# Altium schematic sheet RoBeast_Current_Sense.SchDoc: Current Sense
size A4; ApprovedBy: CR; DrawnBy: VM & IG; Revision: V1; SheetNumber: 8; SheetTotal: 9
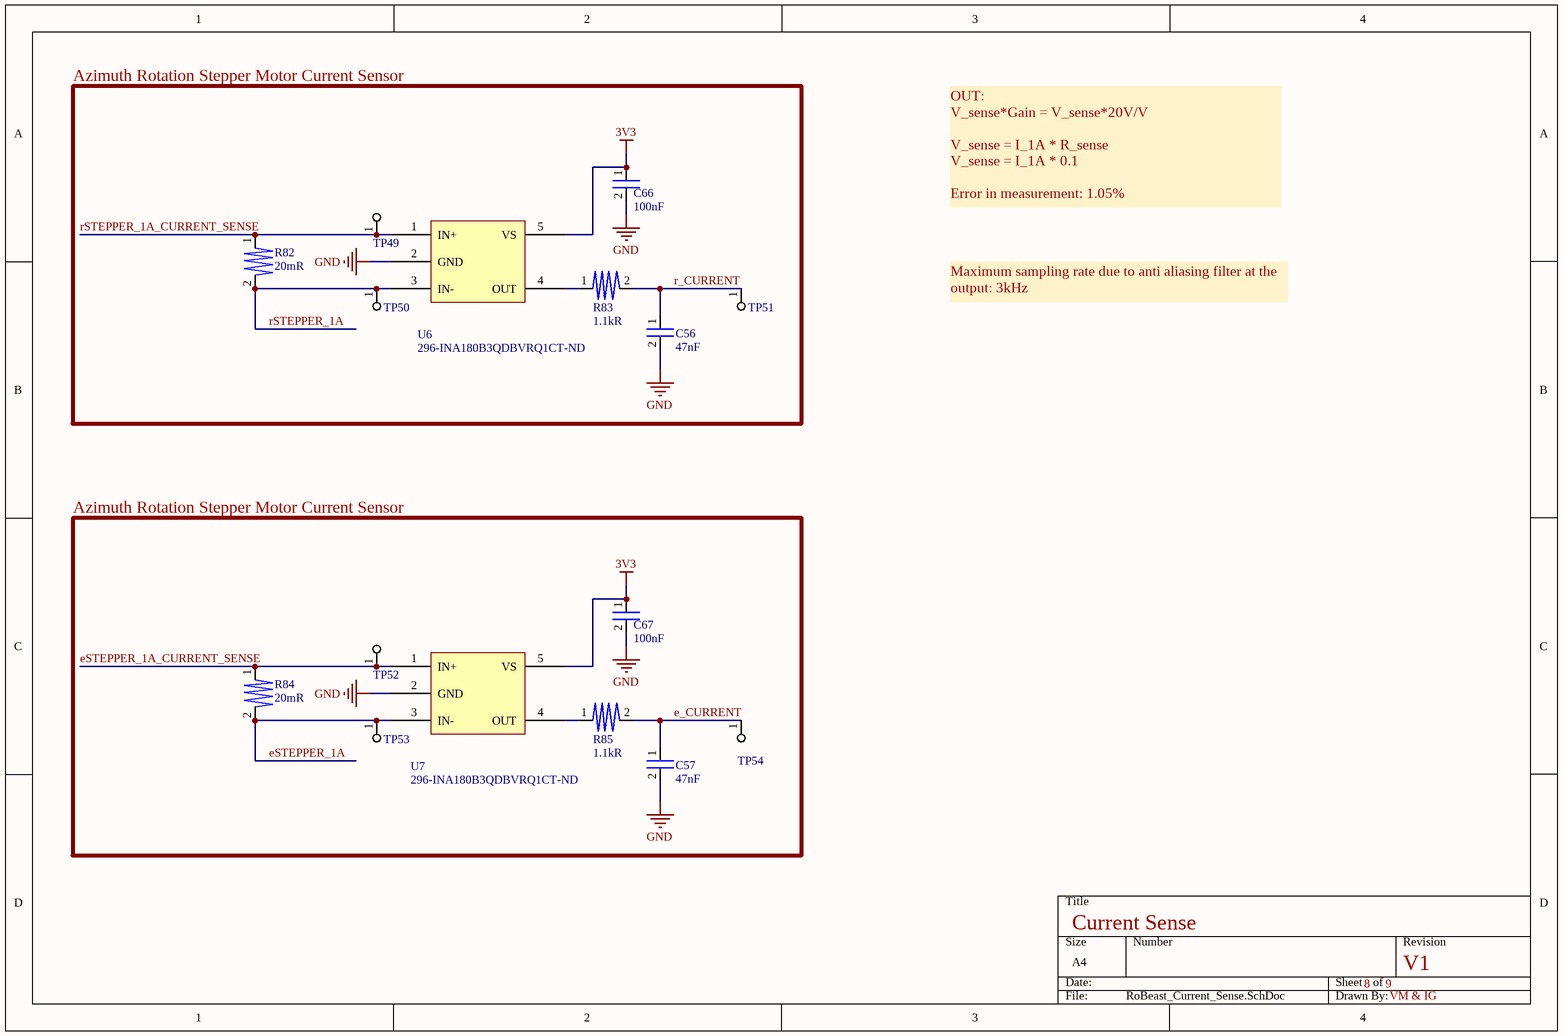
[diagram p0: RoBeast_Current_Sense.SchDoc]

## Parts
C56  47nF  [0805]
C57  47nF  [0805]
C66  100nF  [0805]
C67  100nF  [0805]
R82  20mR  [0805]
R83  1.1kR  [0805]
R84  20mR  [0805]
R85  1.1kR  [0805]
TP49  Test Point  [RCWCTE]  (value not drawn)
TP50  Test Point  [RCWCTE]  (value not drawn)
TP51  Test Point  [RCWCTE]  (value not drawn)
TP52  Test Point  [RCWCTE]  (value not drawn)
TP53  Test Point  [RCWCTE]  (value not drawn)
TP54  Test Point  [RCWCTE]  (value not drawn)
U6  Supplier Part Number 1: 296-INA180B3QDBVRQ1CT-ND  [INA180B3QDBVRQ1]  (hidden comment: Current Sensor, Gain 100V/V)
U7  Supplier Part Number 1: 296-INA180B3QDBVRQ1CT-ND  [INA180B3QDBVRQ1]  (hidden comment: Current Sensor, Gain 100V/V)

## Blocks framed on the sheet
Azimuth Rotation Stepper Motor Current Sensor: C56 C66 R82 R83 TP49-TP51 U6
Azimuth Rotation Stepper Motor Current Sensor: C57 C67 R84 R85 TP52-TP54 U7

## Nets
3V3: C66.1 C67.1 U6.5(VS) U7.5(VS)
GND: C56.2 C57.2 C66.2 C67.2 U6.2(GND) U7.2(GND)
e_CURRENT: C57.1 R85.2 TP54.1
eSTEPPER_1A: R84.2 TP53.1 U7.3(IN-)
eSTEPPER_1A_CURRENT_SENSE: R84.1 TP52.1 U7.1(IN+)
r_CURRENT: C56.1 R83.2 TP51.1
rSTEPPER_1A: R82.2 TP50.1 U6.3(IN-)
rSTEPPER_1A_CURRENT_SENSE: R82.1 TP49.1 U6.1(IN+)
NetR83_1: R83.1 U6.4(OUT)
NetR85_1: R85.1 U7.4(OUT)

## Notes on the sheet
- OUT:
  V_sense*Gain = V_sense*20V/V
  V_sense = I_1A * R_sense
  V_sense = I_1A * 0.1
  Error in measurement: 1.05%
- Maximum sampling rate due to anti aliasing filter at the output: 3kHz

## Library data of the parts
C56 C57 = CL21B473KBCNNNC: Ceramic Capacitor, Multilayer, Ceramic, 50V, 10% +Tol, 10% -Tol, X7R, 15% TC, 0.047uF, Surface Mount, 0805; Manufacturer: Samsung; Multilayer: Yes; Supplier 1: Digikey; Manufacturer Part Number: CL21B473KBCNNNC; RoHS: Yes; Category: Ceramic Capacitors; Stock 1: 502166; Pricing 1: 1=0.1, 10=0.036, 50=0.0208, 100=0.0161, 500=0.01212, 1000=0.00953 (USD); Mount: Surface Mount; Number of Pins: 2; Dielectric Material: Ceramic; Package Shape: Rectangular; Size Code: 0805; Terminal Finish: Nickel; Min Operating Temperature: -55°C; Max Operating Temperature: 125°C; JESD-609 Code: e3; Capacitance: 47nF; Capacitor Type: Ceramic; Negative Tolerance: 10%; Package Style: SMTMeter; Packaging: Tape and Reel; Positive Tolerance: 10%; Rated DC Voltage (URdc): 50V; Temperature Characteristics Code: X7R; Termination: Wraparound; Length: 2mm; Width: 1.25mm; Height: 0.85mm; Reach SVHC Compliant: Yes; RoHS Compliant: Yes; ComponentLink1URL: https://datasheet.ciiva.com:443/pdfs/VipMasterIC/IC/SEMS/SEMS-S-A0008523078/SEMS-S-A0008523078-1.pdf?src-supplier=IHS+Markit; ComponentLink1Description: https://datasheet.ciiva.com:443/pdfs/VipMasterIC/IC/SEMS/SEMS-S-A0008523078/SEMS-S-A0008523078-1.pdf?src-supplier=IHS+Markit; ComponentLink2URL: https://datasheet.ciiva.com/15195/getdatasheetpartid-357428-15195917.pdf?src-supplier=Verical; ComponentLink2Description: https://datasheet.ciiva.com/15195/getdatasheetpartid-357428-15195917.pdf?src-supplier=Verical; ComponentLink3URL: https://datasheet.ciiva.com/29199/454396-da-01-en-vs-kondensator-0805-29199678.pdf?src-supplier=Conrad; ComponentLink3Description: https://datasheet.ciiva.com/29199/454396-da-01-en-vs-kondensator-0805-29199678.pdf?src-supplier=Conrad; ComponentLink4URL: https://datasheet.ciiva.com/16289/cl05b104kq5nnnc-16289529.pdf?src-supplier=Future+Electronics; ComponentLink4Description: https://datasheet.ciiva.com/16289/cl05b104kq5nnnc-16289529.pdf?src-supplier=Future+Electronics; Supplier Part Number 1: 1276-1250-1-ND
C66 C67 = C0805C104J5RAC7800: Ceramic Capacitor, Multilayer, Ceramic, 50V, 5% +Tol, 5% -Tol, X7R, 15% TC, 0.1uF, Surface Mount, 0805; Manufacturer: KEMET; Manufacturer Part Number: C0805C104J5RACTU; Multilayer: Yes; Supplier 1: Digikey; RoHS: Yes; Category: Ceramic Capacitors; Stock 1: 605061; Pricing 1: 1=0.18, 10=0.122, 50=0.0732, 100=0.0576, 500=0.04252, 1000=0.03519 (USD); Mount: Surface Mount; Number of Pins: 2; Dielectric Material: Ceramic; Package Shape: Rectangular; Size Code: 0805; Terminal Finish: Nickel; Min Operating Temperature: -55°C; Max Operating Temperature: 125°C; JESD-609 Code: e3; Capacitor Type: Ceramic; Negative Tolerance: 5%; Packaging: Tape and Reel; Positive Tolerance: 5%; Rated DC Voltage (URdc): 50V; Temperature Characteristics Code: X7R; Termination: Wraparound; Reach SVHC Compliant: Yes; RoHS Compliant: Yes; ComponentLink1URL: http://capacitoredge.kemet.com:80/capedge2/intellispec.jsp?pn=C0805C104J5RACTU&displayPN=C0805C104J5RACTU&src-supplier=IHS+Markit; ComponentLink1Description: http://capacitoredge.kemet.com:80/capedge2/intellispec.jsp?pn=C0805C104J5RACTU&displayPN=C0805C104J5RACTU&src-supplier=IHS+Markit; ComponentLink2URL: https://datasheet.ciiva.com/7842/1732721-7842179.pdf?src-supplier=Element14; ComponentLink2Description: https://datasheet.ciiva.com/7842/1732721-7842179.pdf?src-supplier=Element14; ComponentLink3URL: https://datasheet.ciiva.com/28682/1851736-28682223.pdf?src-supplier=Element14; ComponentLink3Description: https://datasheet.ciiva.com/28682/1851736-28682223.pdf?src-supplier=Element14; ComponentLink4URL: https://datasheet.ciiva.com/7258/1828800-7258413.pdf?src-supplier=Newark; ComponentLink4Description: https://datasheet.ciiva.com/7258/1828800-7258413.pdf?src-supplier=Newark; ComponentLink5URL: https://datasheet.ciiva.com/14589/70095383-14589015.pdf?src-supplier=Allied+Electronics; ComponentLink5Description: https://datasheet.ciiva.com/14589/70095383-14589015.pdf?src-supplier=Allied+Electronics; ComponentLink6URL: https://datasheet.ciiva.com/5417/kem-c1002-x7r-smd-5417352.pdf?src-supplier=Mouser; ComponentLink6Description: https://datasheet.ciiva.com/5417/kem-c1002-x7r-smd-5417352.pdf?src-supplier=Mouser; ComponentLink7URL: https://datasheet.ciiva.com/39122/docfinderpartnumberc0402c102k5ractu-39122924.pdf?src-supplier=Onlinecomponents.com; ComponentLink7Description: https://datasheet.ciiva.com/39122/docfinderpartnumberc0402c102k5ractu-39122924.pdf?src-supplier=Onlinecomponents.com; Supplier Part Number 1: 399-C0805C104J5RAC7800CT-ND; Capacitance: 100nF
R82 R84 = ERJ-6CWDR020V: Resistor Thick Film 0.02Ohm 0.5% 0.5W 2-Pin 0805 T/R; Manufacturer: Panasonic; Supplier 1: Digikey; Manufacturer Part Number: ERJ-6CWDR020V; RoHS: No; Category: Chip SMD Resistors; Stock 1: 1997; Pricing 1: 1=0.61, 10=0.427, 25=0.3652, 50=0.3176, 100=0.2488, 250=0.22764, 500=0.1853, 1000=0.14697 (USD); ComponentLink1URL: https://datasheet.octopart.com/ERJ-6CWDR020V-Panasonic-datasheet-68299093.pdf?src-supplier=Future+Electronics; ComponentLink1Description: https://datasheet.octopart.com/ERJ-6CWDR020V-Panasonic-datasheet-68299093.pdf?src-supplier=Future+Electronics; ComponentLink2URL: http://industrial.panasonic.com/cdbs/www-data/pdf/RDN0000/AOA0000C313.pdf?src-supplier=Newark; ComponentLink2Description: http://industrial.panasonic.com/cdbs/www-data/pdf/RDN0000/AOA0000C313.pdf?src-supplier=Newark; ComponentLink3URL: http://industrial.panasonic.com/cdbs/www-data/pdf/RDN0000/AOA0000C313.pdf?src-supplier=Farnell; ComponentLink3Description: http://industrial.panasonic.com/cdbs/www-data/pdf/RDN0000/AOA0000C313.pdf?src-supplier=Farnell; ComponentLink4URL: https://industrial.panasonic.com/cdbs/www-data/pdf/RDN0000/AOA0000C313.pdf?src-supplier=Digikey; ComponentLink4Description: https://industrial.panasonic.com/cdbs/www-data/pdf/RDN0000/AOA0000C313.pdf?src-supplier=Digikey; Supplier Part Number 1: P124408CT-ND
R83 R85 = RCS08051K10FKEA: Fixed Resistor, Metal Glaze/thick Film, 0.4W, 1100ohm, 150V, 1% +/-Tol, 100ppm/Cel, Surface Mount, 0805; Manufacturer: Vishay Dale; Supplier 1: Digikey; Manufacturer Part Number: RCS08051K10FKEA; RoHS: Yes; Category: Chip SMD Resistors; Stock 1: 9985; Pricing 1: 1=0.2, 10=0.104, 50=0.0712, 100=0.0613, 500=0.045, 1000=0.03986 (USD); ComponentLink1URL: https://datasheet.ciiva.com:443/pdfs/VipMasterIC/IC/VISH/VISH-S-A0007978036/VISH-S-A0007978036-1.pdf?src-supplier=IHS+Markit; ComponentLink1Description: https://datasheet.ciiva.com:443/pdfs/VipMasterIC/IC/VISH/VISH-S-A0007978036/VISH-S-A0007978036-1.pdf?src-supplier=IHS+Markit; ComponentLink2URL: http://www.vishay.com/docs/20065/rcse3.pdf?src-supplier=Digikey; ComponentLink2Description: http://www.vishay.com/docs/20065/rcse3.pdf?src-supplier=Digikey; Supplier Part Number 1: 541-RCS08051K10FKEACT-ND
TP49-TP54 = RCWCTE: Testing/Accessories; Manufacturer: KOA Speer; Rated Temperature: 70°C; Resistance: 0R; Package Height: 2mm; Package Length: 3.2mm; Package Width: 1.6mm; Reference Standard: AEC-Q200; Supplier 1: Digikey; Manufacturer Part Number: RCWCTE; RoHS: Yes; Category: Chip SMD Resistors; Stock 1: 132357; Pricing 1: 1=0.16, 10=0.137, 25=0.1212, 50=0.1132, 100=0.105, 250=0.09292, 500=0.08888, 1000=0.07272 (USD); Mount: Surface Mount; Number of Pins: 2; Package Shape: Rectangular; Size Code: 1206; Terminal Finish: Copper; Min Operating Temperature: -55°C; Max Operating Temperature: 125°C; JESD-609 Code: e2; Resistor Type: FIXED RESISTOR; Construction: Chip; Package Style: SMTMeter; Packaging: Tape and Reel; Termination: Wraparound; Reach SVHC Compliant: Yes; RoHS Compliant: Yes; ComponentLink1URL: https://datasheet.ciiva.com:443/pdfs/VipMasterIC/IC/KOAS/KOASS03065/KOASS03065-1.pdf?src-supplier=IHS+Markit; ComponentLink1Description: https://datasheet.ciiva.com:443/pdfs/VipMasterIC/IC/KOAS/KOASS03065/KOASS03065-1.pdf?src-supplier=IHS+Markit; ComponentLink2URL: https://datasheet.ciiva.com/34302/1876186-34302940.pdf?src-supplier=Jameco; ComponentLink2Description: https://datasheet.ciiva.com/34302/1876186-34302940.pdf?src-supplier=Jameco; ComponentLink3URL: https://datasheet.ciiva.com/5556/rc-5556236.pdf?src-supplier=Mouser; ComponentLink3Description: https://datasheet.ciiva.com/5556/rc-5556236.pdf?src-supplier=Mouser; ComponentLink4URL: https://datasheet.ciiva.com/26821/getdatasheetpartid-110197-26821157.pdf?src-supplier=Verical; ComponentLink4Description: https://datasheet.ciiva.com/26821/getdatasheetpartid-110197-26821157.pdf?src-supplier=Verical; Supplier Part Number 1: 2019-RCWCTECT-ND
U6 U7 = INA180B3QDBVRQ1: Operational Amplifier, 1 Func, 500uV Offset-Max, PDSO5; Manufacturer: Texas Instruments; Supplier 1: Digikey; Manufacturer Part Number: INA180B3QDBVRQ1; RoHS: Yes; Category: Amplifiers - Op Amps, Buffer, Instrumentation; Stock 1: 5909; Pricing 1: 1=0.58, 10=0.492, 25=0.4596, 100=0.3676, 250=0.34136, 500=0.28886, 1000=0.22321 (USD)